# EAGLE design power_switch (EAGLE 9.4.2)
Assembly variants: pinout, basic, FIX
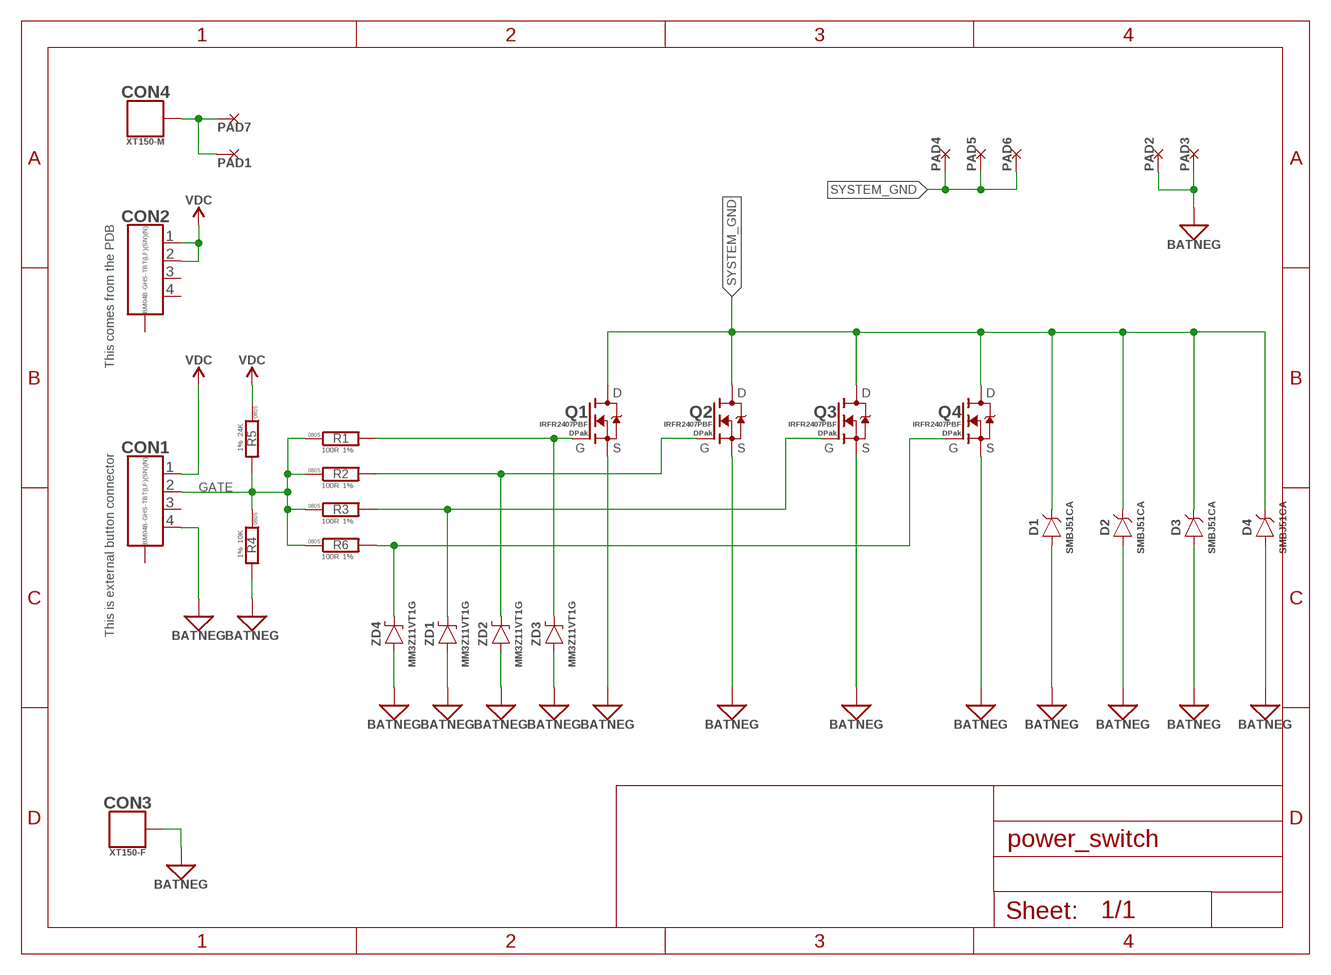
[diagram p0: schematic, sheet 1]

## Parts
CON1  CON-4P-TABS-JST-GH-TOP  [BM04B-GHS-TB]
CON2  CON-4P-TABS-JST-GH-TOP  [BM04B-GHS-TB]
CON3  CON-1P-XT150-FEMALE-PIN  [XT150-FEMALE-PIN]
CON4  CON-1P-XT150-MALE-PIN  [XT150-MALE-PIN]
D1  SMBJ51CA-SMB  [DO-214AA(SMB)]
D2  SMBJ51CA-SMB  [DO-214AA(SMB)]
D3  SMBJ51CA-SMB  [DO-214AA(SMB)]
D4  SMBJ51CA-SMB  [DO-214AA(SMB)]
PAD1  PAD-5X8  [5X8]
PAD2  PAD-5X8  [5X8]
PAD3  PAD-5X8  [5X8]
PAD4  PAD-5X8  [5X8]  (not fitted in variant basic)  (not fitted in variant pinout)  (not fitted in variant FIX)
PAD5  PAD-5X8  [5X8]
PAD6  PAD-5X8  [5X8]
PAD7  PAD-5X8  [5X8]
Q1  IRFR2407PBF  [D-PAK]
Q2  IRFR2407PBF  [D-PAK]
Q3  IRFR2407PBF  [D-PAK]
Q4  IRFR2407PBF  [D-PAK]
R1  100R  R-1%-0805  [R0805]
R2  100R  R-1%-0805  [R0805]
R3  100R  R-1%-0805  [R0805]
R4  10K  R-1%-0805  [R0805]
R5  24K  R-1%-0805  [R0805]
R6  100R  R-1%-0805  [R0805]
ZD1  MM3Z11V  [SOD323]
ZD2  MM3Z11V  [SOD323]
ZD3  MM3Z11V  [SOD323]
ZD4  MM3Z11V  [SOD323]

## Nets
BAT_POSITIVE: CON4.P$1 PAD1.P$1 PAD7.P$1
BATNEG: CON1.4 CON3.P$1 D1.A D2.A D3.A D4.A PAD2.P$1 PAD3.P$1 Q1.S Q2.S Q3.S Q4.S R4.2 ZD1.A ZD2.A ZD3.A ZD4.A
GATE: CON1.2 R1.1 R2.1 R3.1 R4.1 R5.2 R6.1
N$1: Q2.G R2.2 ZD2.C
N$2: Q3.G R3.2 ZD1.C
N$3: Q1.G R1.2 ZD3.C
N$4: Q4.G R6.2 ZD4.C
SYSTEM_GND: D1.C D2.C D3.C D4.C PAD4.P$1 PAD5.P$1 PAD6.P$1 Q1.D Q2.D Q3.D Q4.D
VDC [HV]: CON1.1 CON2.1 CON2.2 R5.1
Unconnected: CON1.3 CON1.M$0(GND) CON1.M$1(GND) CON2.3 CON2.4 CON2.M$0(GND) CON2.M$1(GND)

## Notes on the sheet
- This comes from the PDB
- This is external button connector

## Library data of the parts
CON1 CON2 = Connectors:CON-4P-TABS: Connector Receptacle 4 Position; DIGIKEY#: 455-1580-2-ND; ENTRY: TOP; LCSC#: C161692; MANF: JST Sales America Inc; MANF#: BM04B-GHS-TBT(LF)(SN)(N); OPERATING_TEMP: -25°C ~ 85°C
CON3 = Connectors:CON-1P; MANF: AMASS; MANF#: XT150-F
CON4 = Connectors:CON-1P; MANF: AMASS; MANF#: XT150-M
D1-D4 = TVS_diodes:SMBJ51CA: TVS DIODE 51VWM SMD; DIGIKEY#: SMBJ51CABCT-ND; MANF: Bourns Inc; MANF#: SMBJ51CA
PAD1-PAD7 = PADS:PAD
Q1-Q4 = mosfet:IRFR2407PBF: N-Channel 75V 42A power MOSFET, Rdson = 0.026 Ohm; LCSC#: C40514; MANF: International Rectifier; MANF#: IRFR2407PBF; PACKAGE: DPak
R1-R6 = rc:R; PACKAGE: 0805; TOLERANCE: 1%
ZD1-ZD4 = Diodes:MM3Z: Zener Diode 200-300mW ±6% Surface Mount SOD-323 (or SOD-323FL); LCSC#: C242271; MANF: onsemi; MANF#: MM3Z11VT1G

## Net classes
1 HV: clearance 0.5 mm to class 0, clearance 0.5 mm

## Board
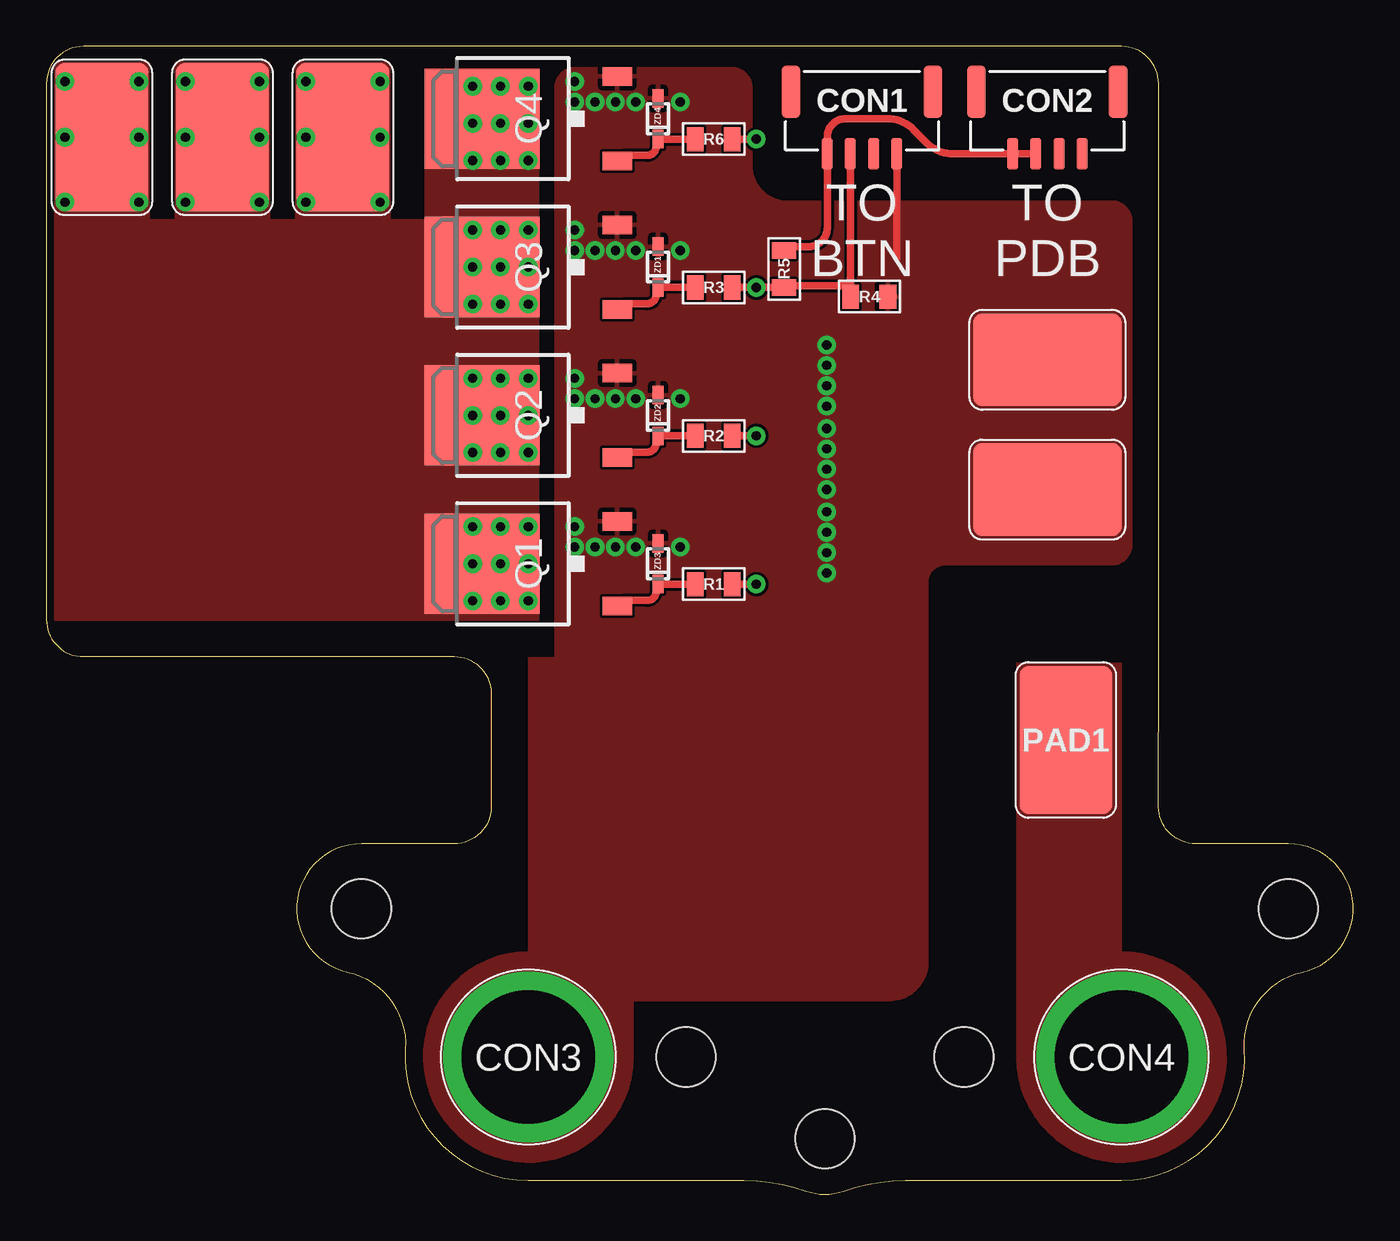
[diagram p1: board, top side]
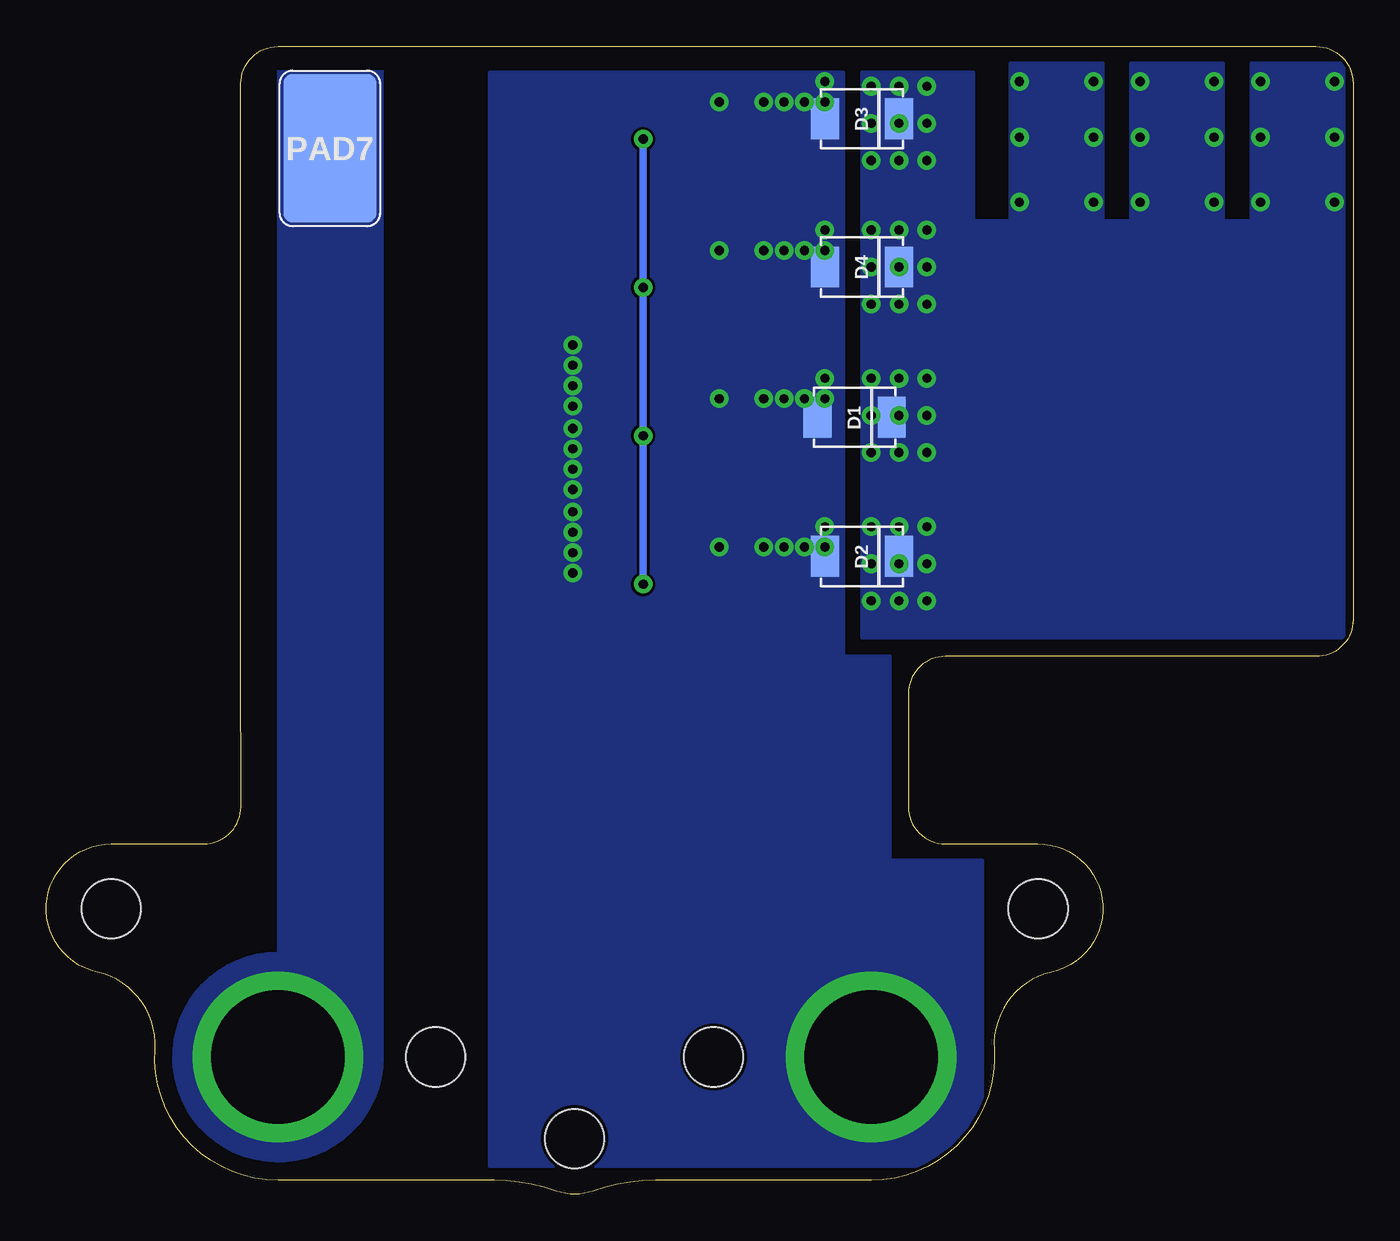
[diagram p2: board, bottom side, seen from below]

Size 70.5 x 61.9 mm. Coordinates in mm from the lower left corner, seen from the top.
Outline: 60,28.9 60,59.87 arc90 58,61.9 2,61.9 arc90 0,59.91 0,30.99 arc90 2,29 22,29 arc-90 24,27 24,20.9 arc-90 22,18.9 17,18.9 arc167 16.24,11.98 arc-81 19.36,7.82 arc94 26,0.75 37.65,0.75 arc-20 41,0.17 arc39 43,0.17 arc-20 46.35,0.75 58,0.75 arc94 64.64,7.82 arc-81 67.76,11.98 arc167 67,18.9 62,18.9 arc-90 60,20.9 60,28.9
Copper layers (1*16): Top 0.035mm / dielectric 1.5mm / Bottom 0.035mm
Design rules "JLCPCB 2 layer": minimum track width 6mil, minimum drill 0.3mm, track to track 0.15mm, track to pad 0.15mm, pad to pad 0.15mm, via to via 0.15mm, smd to smd 0.1mm, copper to edge 0.2mm, drill to drill 6mil, minimum pad ring 0.15mm, minimum via ring 0.15mm, stop-mask expansion 0.05mm, vias tented up to drill 0.3mm, thermal gap 10mil
Holes 3.2 mm at 17,15.4 67,15.4 34.5,7.4 49.5,7.4 42,3
tRestrict: area -44.5,41.8 to -38,48.3; area -14,41.8 to -7.5,48.3

### Footprints (pad centres in the part's own frame; a part is rotated, then mirrored left to right if it is on the bottom)
BM04B-GHS-TB = smd 0.6 x 1.7: 1 -1.875,-2.9; 2 -0.625,-2.9; 3 0.625,-2.9; 4 1.875,-2.9 | smd 1 x 2.8: M$0 -3.825,0.45; M$1 3.825,0.45
XT150-FEMALE-PIN = drill 7.2 pad 9.2: P$1 0,0
XT150-MALE-PIN = drill 7.2 pad 9.2: P$1 0,0
DO-214AA(SMB) = smd 1.5 x 2.2: A -2,0; C 2,0
5X8 = smd 5 x 8: P$1 0,0
D-PAK = smd 5.4 x 6.2: D 0,2.5 | smd 1 x 1.6: G -2.28,-4.8; S 2.28,-4.8
R0805 = smd 0.9 x 1.3: 1 -1,0; 2 1,0
SOD323 = smd 1 x 0.6: A 1.1,0; C -1.1,0

### Placement (x,y rotation side)
CON1  44,59 0 top
CON2  54,59 0 top
CON3  26,7.4 0 top
CON4  58,7.4 0 top
D1  26.9,41.9 0 bottom
D2  26.5,34.4 0 bottom
D3  26.5,58 0 bottom
D4  26.5,50 0 bottom
PAD1  55,24.5 0 top
PAD2  54,38 90 top
PAD3  54,45 90 top
PAD4  9.5,57 180 top
PAD5  16,57 180 top
PAD6  3,57 0 top
PAD7  55.2,56.4 0 bottom
Q1  26,34 90 top
Q2  26,42 90 top
Q3  26,50 90 top
Q4  26,58 90 top
R1  36,32.9 180 top
R2  36,40.9 180 top
R3  36,48.9 180 top
R4  44.4,48.4 0 top
R5  39.8,49.9 270 top
R6  36,56.9 180 top
ZD1  33,50 90 top
ZD2  33,42 90 top
ZD3  33,34 90 top
ZD4  33,58 90 top

### Tracks (layer width: path | path; a pad name or v marks a point on that pad's centre or on a via)
BAT_POSITIVE
  pour Bottom (no thermals): 52.35,60.6 52.35,7.4 52.35,7.4 arc270 58,13.05 58,60.6
  pour Top (no thermals): 52.35,28.6 52.35,7.4 arc270 58,13.05 58,28.6
BATNEG  (via drill 0.5 pad 1)
  Top 0.4: CON1.4 45.87,50.5
  other vias: 28.5,60 28.5,58.9 29.6,58.9 30.7,58.9 34.2,58.9 31.8,58.9 28.5,36 28.5,34.9 29.6,34.9 30.7,34.9 34.2,34.9 31.8,34.9 28.5,44 28.5,42.9 29.6,42.9 30.7,42.9 34.2,42.9 31.8,42.9 28.5,52 28.5,50.9 29.6,50.9 30.7,50.9 34.2,50.9 31.8,50.9 42.1,42.5 42.1,43.6 42.1,44.7 42.1,45.8 42.1,38 42.1,39.1 42.1,40.2 42.1,41.3 42.1,33.5 42.1,34.6 42.1,35.7 42.1,36.8
  pour Top (no thermals): 26,28.9 26,13.05 arc270 31.65,7.4 31.65,28.9
  pour Bottom (no thermals): 25,18 25,29 27.5,29 27.5,60.5 46.6,60.5 46.6,1.5 20,1.5 20,18
  pour Top: 38,55.5 38,59.7 arc90 37,60.7 28.5,60.7 arc90 27.5,59.7 27.5,10.5 45.5,10.5 arc90 47.5,12.5 47.5,33 arc-90 48.5,34 57.5,34 arc90 58.5,35 58.5,52.5 arc90 57.5,53.5 40,53.5 arc-90
  pour Top (no thermals): 49.2,48 58.4,48 58.4,34.9 49.2,34.9
GATE  (via drill 0.5 pad 1)
  Top 0.4: R6.1 v38.3,56.9 | R3.1 v38.3,48.9 R5.2 39.9,49 43.3,49 43.37,49.08 | R2.1 v38.3,40.9 | R1.1 v38.3,32.9 | CON1.2 43.37,49.08 | R4.1 43.37,48.43 43.37,49.08
  Bottom 0.4: v38.3,56.9 v38.3,48.9 v38.3,40.9 v38.3,32.9
N$1
  Top 0.4: Q2.G 31.1,40.02 32.4,40.02 arc90 32.9,40.52 32.9,40.8 ZD2.C R2.2
N$2
  Top 0.4: Q3.G 31.1,48.02 32.4,48.02 arc90 32.9,48.52 32.9,48.8 ZD1.C R3.2
N$3
  Top 0.4: Q1.G 31.1,32.02 32.4,32.02 arc90 32.9,32.52 32.9,32.8 ZD3.C R1.2
N$4
  Top 0.4: R6.2 ZD4.C 32.9,56.8 32.9,56.52 arc-90 32.4,56.02 31.1,56.02 Q4.G
SYSTEM_GND  (via drill 0.5 pad 1)
  Top 0.2: PAD6.P$1 v1,57
  other vias: 1,60 5,60 5,57 5,53.5 1,53.5 14,60 18,60 18,57 18,53.5 14,53.5 14,57 7.5,60 11.5,60 11.5,57 11.5,53.5 7.5,53.5 7.5,57 23,59.75 24.5,59.75 26,59.75 26,57.75 24.5,57.75 23,57.75 23,55.75 24.5,55.75 26,55.75 23,36 24.5,36 26,36 26,34 24.5,34 23,34 23,32 24.5,32 26,32 23,44 24.5,44 26,44 26,42 24.5,42 23,42 23,40 24.5,40 26,40 23,52 24.5,52 26,52 26,50 24.5,50 23,50 23,48 24.5,48 26,48
  pour Top (no thermals): 0.5,61 0.5,51.5 5.5,51.5 5.5,61
  pour Top (no thermals): 7,61 7,51.5 12,51.5 12,61
  pour Top (no thermals): 13.5,61 13.5,51.5 18.5,51.5 18.5,61
  pour Top (no thermals): 20.5,60.5 20.5,52.5 0.5,52.5 0.5,31 26.5,31 26.5,60.5
  pour Bottom (no thermals): 20.5,60.5 20.5,52.5 0.5,52.5 0.5,30 26.5,30 26.5,60.5
  pour Bottom (no thermals): 13.5,61 13.5,51.5 18.5,51.5 18.5,61
  pour Bottom (no thermals): 7,61 7,51.5 12,51.5 12,61
  pour Bottom (no thermals): 0.5,61 0.5,51.5 5.5,51.5 5.5,61
VDC
  Top 0.4: CON2.2 CON2.1 48.93,56.1 arc-45 47.51,56.69 46.79,57.41 arc45 45.37,58 43.12,58 arc90 42.12,57 CON1.1 42.12,52.1 arc-90 41.12,51.1 40,51.1 R5.1

### Text on the board
tPlace: TO / BTN | TO / PDB
tDocu: +